# Altium project smart generator controller.PrjPcb
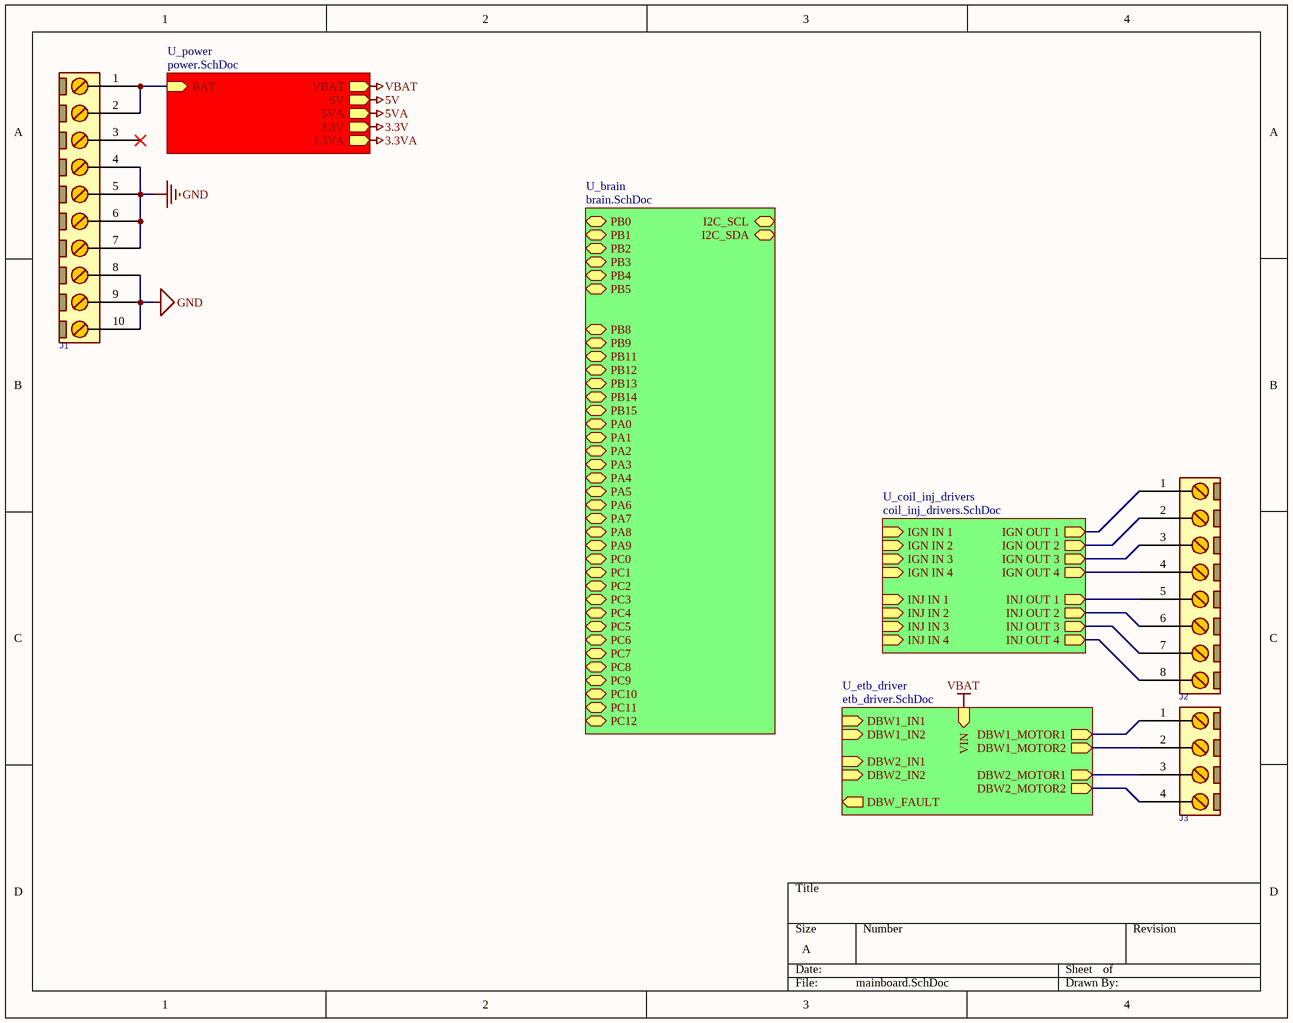
[diagram p0: mainboard.SchDoc]
8 sheets, 276 parts. Net scope: hierarchical (ports join the sheet entries above them; power ports are global).
Board file: PCB1.PcbDoc
Sheets:
  mainboard.SchDoc
    U_etb_driver = etb_driver.SchDoc
    U_brain = brain.SchDoc
    U_power = power.SchDoc
    U_coil_inj_drivers = coil_inj_drivers.SchDoc
  trigger_interface.SchDoc
  output_drivers.SchDoc
  exhaust_gas_temp_oxy.SchDoc

## Sheet mainboard.SchDoc
size A; SheetNumber: 1; SheetTotal: 5

### Parts
J1  CONN_TB10  [MSTB_10]  (value not drawn)
J2  CONN_TB8  [MSTB_8]  (value not drawn)
J3  CONN_TB4  [MSTB_4]  (value not drawn)

### Sub-sheets
U_brain = brain.SchDoc: PB0 (bidir), PB1 (bidir), PB2 (bidir), PB3 (bidir), PB4 (bidir), PB5 (bidir), I2C_SCL (bidir), I2C_SDA (bidir), PB8 (bidir), PB9 (bidir), PB11 (bidir), PB12 (bidir), PB13 (bidir), PB14 (bidir), PB15 (bidir), PA0 (bidir), PA1 (bidir), PA2 (bidir), PA3 (bidir), PA4 (bidir), PA5 (bidir), PA6 (bidir), PA7 (bidir), PA8 (bidir), PA9 (bidir), PC0 (bidir), PC1 (bidir), PC2 (bidir), PC3 (bidir), PC4 (bidir), PC5 (bidir), PC6 (bidir), PC7 (bidir), PC8 (bidir), PC9 (bidir), PC10 (bidir), PC11 (bidir), PC12 (bidir)
U_coil_inj_drivers = coil_inj_drivers.SchDoc: IGN IN 1 (in), IGN IN 2 (in), IGN IN 3 (in), IGN IN 4 (in), IGN OUT 1 (out), IGN OUT 2 (out), IGN OUT 3 (out), IGN OUT 4 (out), INJ OUT 4 (out), INJ OUT 3 (out), INJ OUT 2 (out), INJ OUT 1 (out), INJ IN 1 (in), INJ IN 2 (in), INJ IN 3 (in), INJ IN 4 (in)
U_etb_driver = etb_driver.SchDoc: VIN (in), DBW1_IN1 (in), DBW1_IN2 (in), DBW2_IN1 (in), DBW2_IN2 (in), DBW1_MOTOR1 (out), DBW1_MOTOR2 (out), DBW2_MOTOR1 (out), DBW2_MOTOR2 (out), DBW_FAULT (out)
U_power = power.SchDoc: BAT (in), VBAT (out), 5V (out), 5VA (out), 3.3V (out), 3.3VA (out)

### Nets
GND: J1.4 J1.5 J1.6 J1.7 J1.8 J1.9 J1.10
VBAT: sheet U_etb_driver/VIN, sheet U_power/VBAT
NetD1_1: J2.5 ; sheet U_coil_inj_drivers/INJ OUT 1
NetD1_2: J2.6 J2.7 J2.8 ; sheet U_coil_inj_drivers/INJ OUT 4, sheet U_coil_inj_drivers/INJ OUT 3, sheet U_coil_inj_drivers/INJ OUT 2
NetF2_1: J1.1 J1.2 ; sheet U_power/BAT
NetJ2_1: J2.1 ; sheet U_coil_inj_drivers/IGN OUT 1
NetJ2_2: J2.2 ; sheet U_coil_inj_drivers/IGN OUT 2
NetJ2_3: J2.3 ; sheet U_coil_inj_drivers/IGN OUT 3
NetJ2_4: J2.4 ; sheet U_coil_inj_drivers/IGN OUT 4
NetJ3_1: J3.1 ; sheet U_etb_driver/DBW1_MOTOR1
NetJ3_2: J3.2 ; sheet U_etb_driver/DBW1_MOTOR2
NetJ3_3: J3.3 ; sheet U_etb_driver/DBW2_MOTOR1
NetJ3_4: J3.4 ; sheet U_etb_driver/DBW2_MOTOR2

Not connected (* = marked no-connect by the designer): J1 3*

### Library data of the parts
J1 = CONN_MSTB_10: CONN, PHOENIX MSTB, 5-G, 5.08mm pitch; PARAM2: 320V; PARAM: 12A; VALUE: CONN_TB10
J2 = CONN_MSTB_8: CONN, PHOENIX MSTB, 5-G, 5.08mm pitch; PARAM2: 320V; PARAM: 12A; VALUE: CONN_TB8
J3 = CONN_MSTB_4: CONN, PHOENIX MSTB, 5-G, 5.08mm pitch; PARAM2: 320V; PARAM: 12A; VALUE: CONN_TB4

## Sheet etb_driver.SchDoc
size A4; SheetNumber: 4; SheetTotal: 8
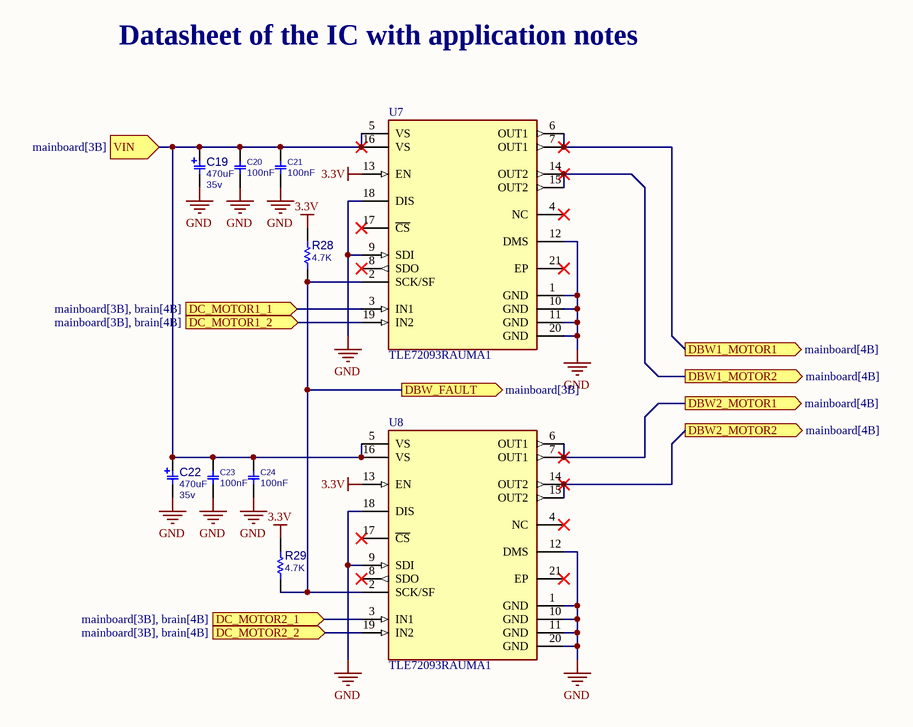
[diagram p1: etb_driver.SchDoc]

### Parts
C19  PARAM2: 35v  [C_EL_D10L10]  (hidden comment: 470uF)
C20  100nF  [C1206]
C21  100nF  [C1206]
C22  PARAM2: 35v  [C_EL_D10L10]  (hidden comment: 470uF)
C23  100nF  [C1206]
C24  100nF  [C1206]
R28  4.7K  [R0805]
R29  4.7K  [R0805]  (no BOM)
U7  TLE72093RAUMA1  [FP-PG-DSO-20-MFG]
U8  TLE72093RAUMA1  [FP-PG-DSO-20-MFG]

### Ports
DBW1_MOTOR1 (out, see mainboard[4B]), DBW1_MOTOR2 (out, see mainboard[4B]), DBW2_MOTOR1 (out, see mainboard[4B]), DBW2_MOTOR2 (out, see mainboard[4B]), DBW_FAULT (out, see mainboard[3B]), DC_MOTOR1_1 (in, see mainboard[3B], brain[4B]), DC_MOTOR1_2 (in, see mainboard[3B], brain[4B]), DC_MOTOR2_1 (in, see mainboard[3B], brain[4B]), DC_MOTOR2_2 (in, see mainboard[3B], brain[4B]), VIN (in, see mainboard[3B])

### Nets
3.3V: R28.2 R29.2 U7.13(EN) U8.13(EN)
GND: C19.2 C20.1 C21.1 C22.2 C23.1 C24.1 U7.1(GND) U7.9(SDI) U7.10(GND) U7.11(GND) U7.12(DMS) U7.18(DIS) U7.20(GND) U8.1(GND) U8.9(SDI) U8.10(GND) U8.11(GND) U8.12(DMS) U8.18(DIS) U8.20(GND)
VBAT: C19.1 C20.2 C21.2 C22.1 C23.2 C24.2 U7.5(VS) U7.16(VS) U8.5(VS) U8.16(VS) ; port VIN
NetJ3_1: U7.6(OUT1) U7.7(OUT1) ; port DBW1_MOTOR1
NetJ3_2: U7.14(OUT2) U7.15(OUT2) ; port DBW1_MOTOR2
NetJ3_3: U8.6(OUT1) U8.7(OUT1) ; port DBW2_MOTOR1
NetJ3_4: U8.14(OUT2) U8.15(OUT2) ; port DBW2_MOTOR2
NetR28_1: R28.1 R29.1 U7.2(SCK/SF) U8.2(SCK/SF) ; port DBW_FAULT
NetU7_3: U7.3(IN1) ; port DC_MOTOR1_1
NetU7_19: U7.19(IN2) ; port DC_MOTOR1_2
NetU8_3: U8.3(IN1) ; port DC_MOTOR2_1
NetU8_19: U8.19(IN2) ; port DC_MOTOR2_2

Not connected (* = marked no-connect by the designer): U7 4(NC)* 8(SDO)* 17(~{CS})* 21(EP)*; U8 4(NC)* 8(SDO)* 17(~{CS})* 21(EP)*

### Notes on the sheet
- Datasheet of the IC with application notes <https://www.infineon.com/dgdl/Infineon-TLE7209_2R-DS-v01_05-en.pdf?fileId=db3a30431f848401011fc76ca8e77a06>

### Library data of the parts
C19 C22 = CAP_SMD_EL_470uF_35v: CAP, SMD, ELEC,; MANF_P#: MANF_PART#; DESC: DESCRIPTION; DIST#: MOUSER; PARAM: 20%; PRICE: 10= -$; MANF: MANF; ASSEMBLY: ASSEMBLY; VALUE: 470uF
C20 C21 C23 C24 = CAP_SMD_MLCC_1206: CAP, MLCC; PARAM: -, -%; MANF_P#: MANF_PART#; PARAM2: -V; PRICE: 100= 1$; MANF: -; ASSEMBLY: ASSEMBLY; VALUE: 100nF
R28 R29 = RES_SMD_0805: RESISTOR, SMD; PARAM: -W; DESC: DESCRIPTION; DIST#: MOUSER; PARAM2: 1%; MANF_P#: -; MANF: -; ASSEMBLY: ASSEMBLY; PRICE: 100= 0.5$; VALUE: 4.7K
U7 U8 = TLE7209: IC MOTOR DRIVER 3.5V-5.5V 20DSO; Logic Function: AND GATE; Max Supply Voltage: 28V; Output Current: 5A; Interface: SPI; RoHS Compliant: Yes; Lead Free: Contains Lead; Series: -; Max Operating Temperature: 150°C; Packaging: Tape and Reel; Mount: Surface Mount; Halogen Free: Halogen Free; Min Operating Temperature: -40°C

## Sheet brain.SchDoc
size A3; SheetNumber: 5; SheetTotal: 8
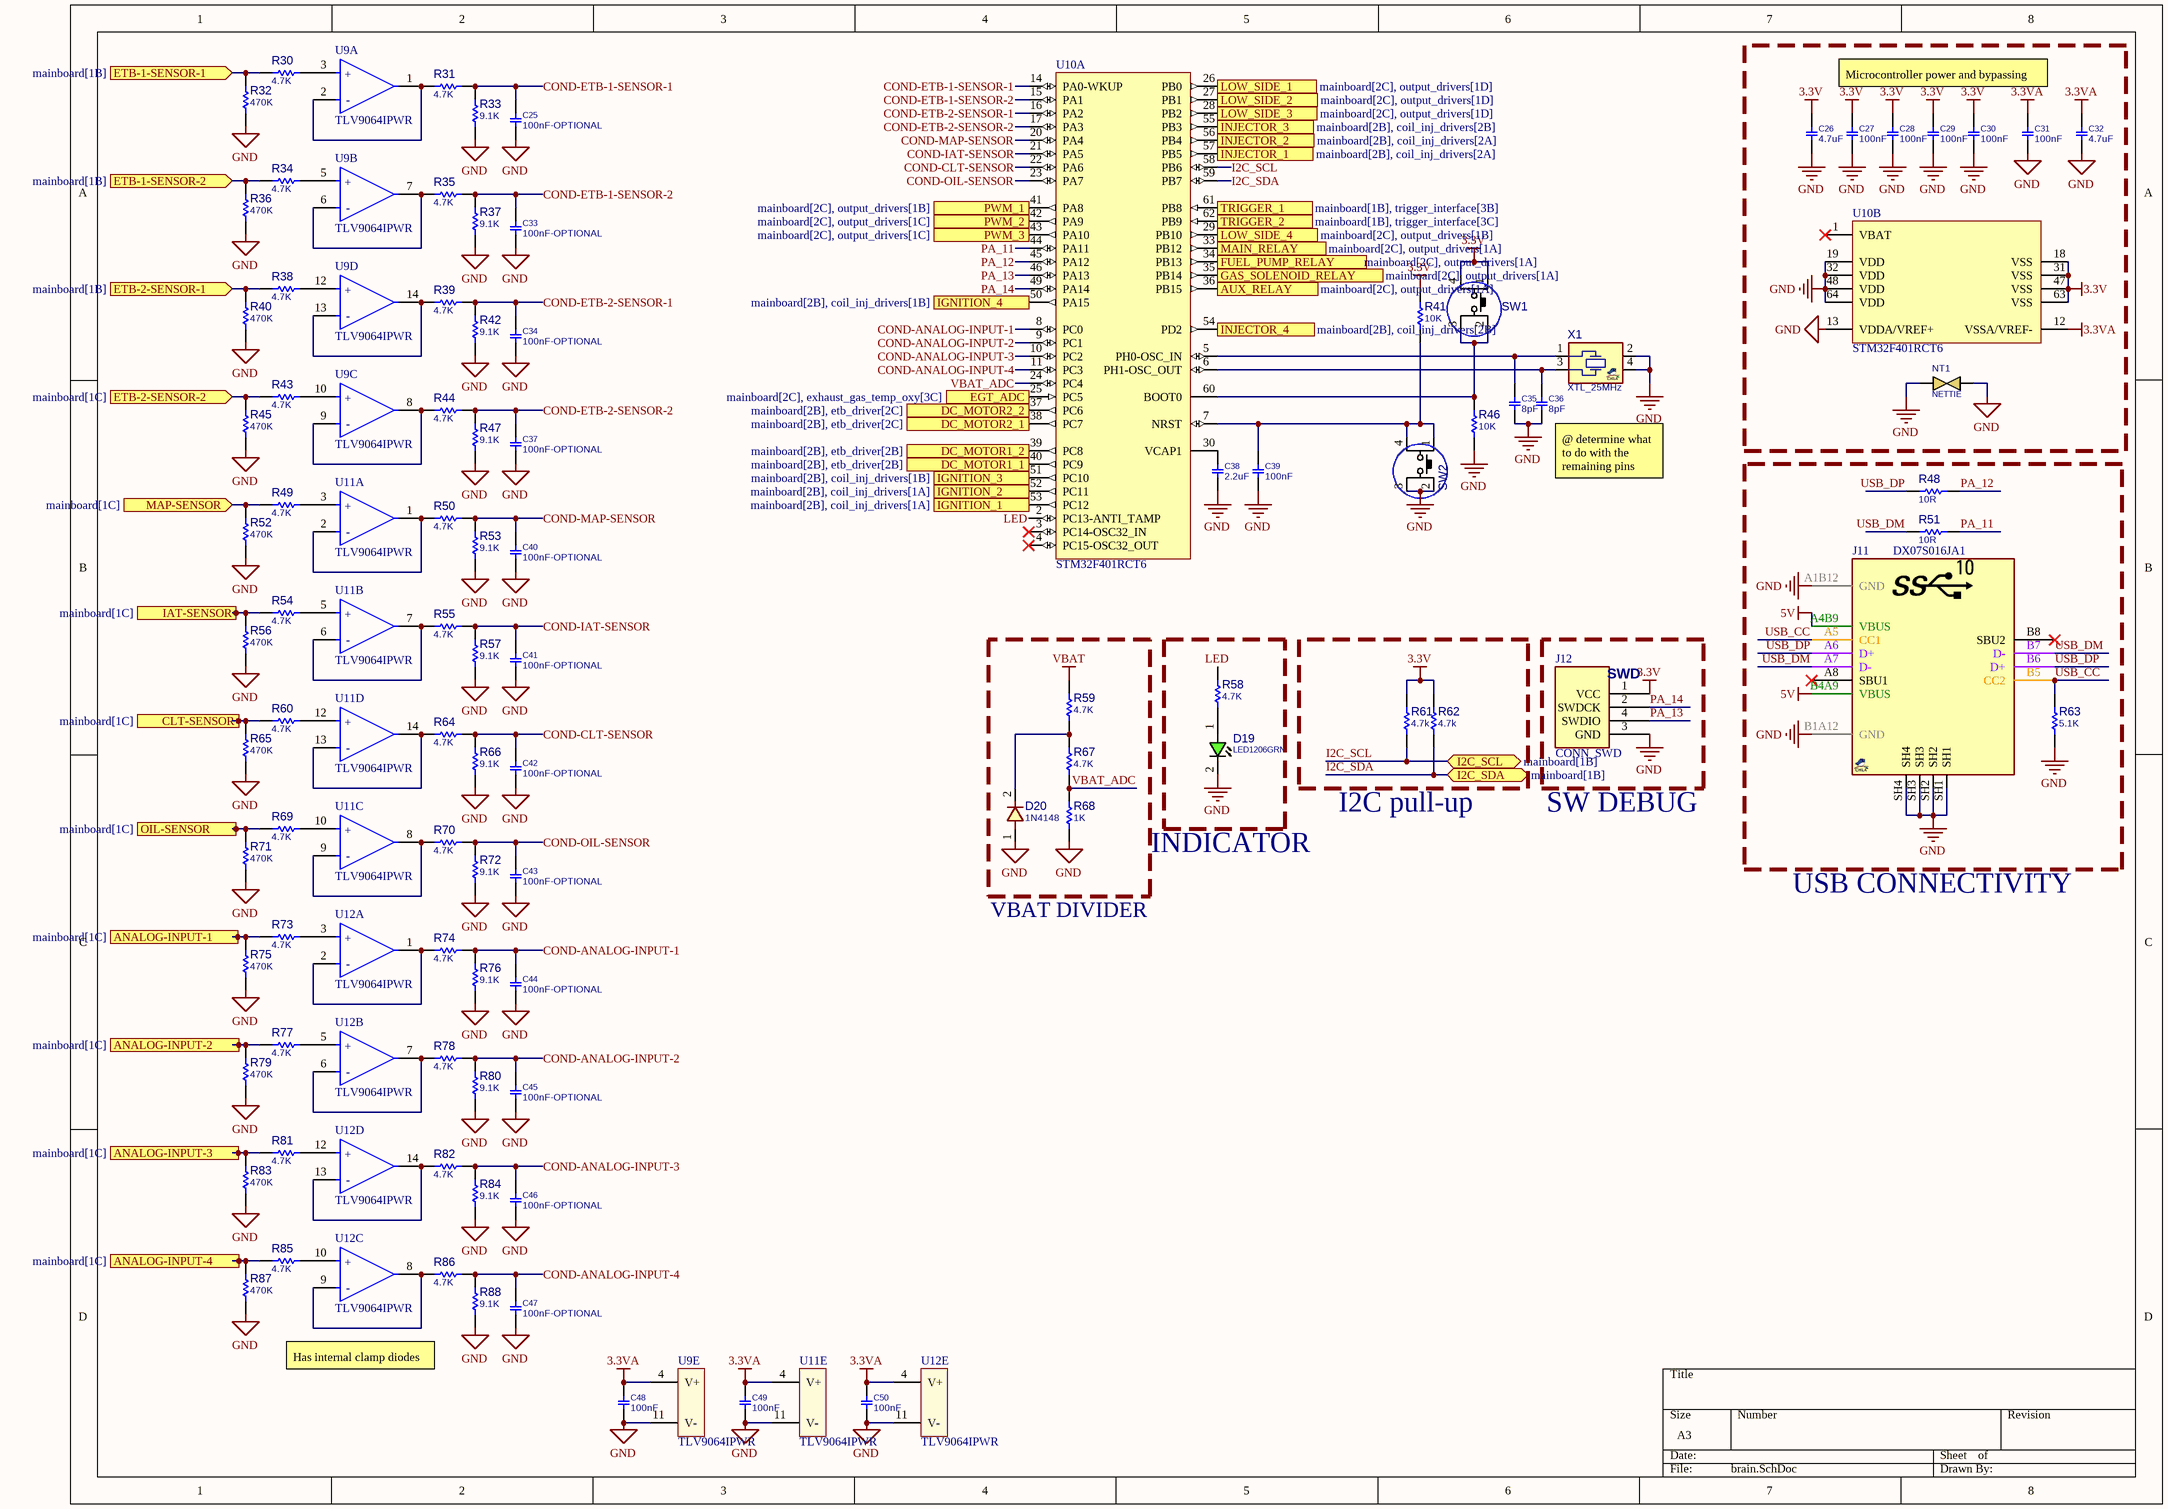
[diagram p2: brain.SchDoc]

### Parts
C25  100nF-OPTIONAL  [C0805]
C26  4.7uF  [C0805]
C27  100nF  [C0805]
C28  100nF  [C0805]
C29  100nF  [C0805]
C30  100nF  [C0805]
C31  100nF  [C0805]
C32  4.7uF  [C0805]
C33  100nF-OPTIONAL  [C0805]
C34  100nF-OPTIONAL  [C0805]
C35  8pF  [C0805]
C36  8pF  [C0805]
C37  100nF-OPTIONAL  [C0805]
C38  2.2uF  [C0805]
C39  100nF  [C0805]
C40  100nF-OPTIONAL  [C0805]
C41  100nF-OPTIONAL  [C0805]
C42  100nF-OPTIONAL  [C0805]
C43  100nF-OPTIONAL  [C0805]
C44  100nF-OPTIONAL  [C0805]
C45  100nF-OPTIONAL  [C0805]
C46  100nF-OPTIONAL  [C0805]
C47  100nF-OPTIONAL  [C0805]
C48  100nF  [C0805]
C49  100nF  [C0805]
C50  100nF  [C0805]
D19  LED1206GRN  [LED1206GRN]
D20  1N4148  [D_SOD80]
J11  DX07S016JA1  [USBC_SMD_16_DX07S016JA1]
J12  CONN_SWD  [WF_4]
NT1  NETTIE  [NETTIE_40X50]  (net tie, no BOM)
R30  4.7K  [R0805]
R31  4.7K  [R0805]
R32  470K  [R0805]
R33  9.1K  [R0805]
R34  4.7K  [R0805]
R35  4.7K  [R0805]
R36  470K  [R0805]
R37  9.1K  [R0805]
R38  4.7K  [R0805]
R39  4.7K  [R0805]
R40  470K  [R0805]
R41  10K  [R0805]
R42  9.1K  [R0805]
R43  4.7K  [R0805]
R44  4.7K  [R0805]
R45  470K  [R0805]
R46  10K  [R0805]
R47  9.1K  [R0805]
R48  10R  [R0805]
R49  4.7K  [R0805]
R50  4.7K  [R0805]
R51  10R  [R0805]
R52  470K  [R0805]
R53  9.1K  [R0805]
R54  4.7K  [R0805]
R55  4.7K  [R0805]
R56  470K  [R0805]
R57  9.1K  [R0805]
R58  4.7K  [R0805]
R59  4.7K  [R0805]
R60  4.7K  [R0805]
R61  4.7k  [R0805]
R62  4.7k  [R0805]
R63  5.1K  [R1206]
R64  4.7K  [R0805]
R65  470K  [R0805]
R66  9.1K  [R0805]
R67  4.7K  [R0805]
R68  1K  [R0805]
R69  4.7K  [R0805]
R70  4.7K  [R0805]
R71  470K  [R0805]
R72  9.1K  [R0805]
R73  4.7K  [R0805]
R74  4.7K  [R0805]
R75  470K  [R0805]
R76  9.1K  [R0805]
R77  4.7K  [R0805]
R78  4.7K  [R0805]
R79  470K  [R0805]
R80  9.1K  [R0805]
R81  4.7K  [R0805]
R82  4.7K  [R0805]
R83  470K  [R0805]
R84  9.1K  [R0805]
R85  4.7K  [R0805]
R86  4.7K  [R0805]
R87  470K  [R0805]
R88  9.1K  [R0805]
SW1  PUSHBUTTON  [SWPBS_SPDT_5X5X1]  (value not drawn)
SW2  PUSHBUTTON  [SWPBS_SPDT_5X5X1]  (value not drawn)
U9  TLV9064IPWR  [TTSOP-14]  (parts A,B,C,D,E of 5)
U10  STM32F401RCT6  [STM-LQFP64_L]  (parts A,B of 2)
U11  TLV9064IPWR  [TTSOP-14]  (parts A,B,C,D,E of 5)
U12  TLV9064IPWR  [TTSOP-14]  (parts A,B,C,D,E of 5)
X1  XTL_25MHz  [XTL_4_3225]

### Blocks framed on the sheet
VBAT DIVIDER: D20 R59 R67 R68

### Ports
ANALOG-INPUT-1 (in, see mainboard[1C]), ANALOG-INPUT-2 (in, see mainboard[1C]), ANALOG-INPUT-3 (in, see mainboard[1C]), ANALOG-INPUT-4 (in, see mainboard[1C]), AUX_RELAY (out, see mainboard[2C], output_drivers[1A]), CLT-SENSOR (in, see mainboard[1C]), DC_MOTOR1_1 (out, see mainboard[2B], etb_driver[2B]), DC_MOTOR1_2 (out, see mainboard[2B], etb_driver[2B]), DC_MOTOR2_1 (out, see mainboard[2B], etb_driver[2C]), DC_MOTOR2_2 (out, see mainboard[2B], etb_driver[2C]), EGT_ADC (in, see mainboard[2C], exhaust_gas_temp_oxy[3C]), ETB-1-SENSOR-1 (in, see mainboard[1B]), ETB-1-SENSOR-2 (in, see mainboard[1B]), ETB-2-SENSOR-1 (in, see mainboard[1B]), ETB-2-SENSOR-2 (in, see mainboard[1C]), FUEL_PUMP_RELAY (out, see mainboard[2C], output_drivers[1A]), GAS_SOLENOID_RELAY (out, see mainboard[2C], output_drivers[1A]), I2C_SCL (bidir, see mainboard[1B]), I2C_SDA (bidir, see mainboard[1B]), IAT-SENSOR (in, see mainboard[1C]), IGNITION_1 (out, see mainboard[2B], coil_inj_drivers[1A]), IGNITION_2 (out, see mainboard[2B], coil_inj_drivers[1A]), IGNITION_3 (out, see mainboard[2B], coil_inj_drivers[1B]), IGNITION_4 (out, see mainboard[2B], coil_inj_drivers[1B]), INJECTOR_1 (out, see mainboard[2B], coil_inj_drivers[2A]), INJECTOR_2 (out, see mainboard[2B], coil_inj_drivers[2A]), INJECTOR_3 (out, see mainboard[2B], coil_inj_drivers[2B]), INJECTOR_4 (out, see mainboard[2B], coil_inj_drivers[2B]), LOW_SIDE_1 (out, see mainboard[2C], output_drivers[1D]), LOW_SIDE_2 (out, see mainboard[2C], output_drivers[1D]), LOW_SIDE_3 (out, see mainboard[2C], output_drivers[1D]), LOW_SIDE_4 (out, see mainboard[2C], output_drivers[1B]), MAIN_RELAY (out, see mainboard[2C], output_drivers[1A]), MAP-SENSOR (in, see mainboard[1C]), OIL-SENSOR (in, see mainboard[1C]), PWM_1 (out, see mainboard[2C], output_drivers[1B]), PWM_2 (out, see mainboard[2C], output_drivers[1C]), PWM_3 (out, see mainboard[2C], output_drivers[1C]), TRIGGER_1 (in, see mainboard[1B], trigger_interface[3B]), TRIGGER_2 (in, see mainboard[1B], trigger_interface[3C])

### Nets
3.3V: C26.2 C27.2 C28.2 C29.2 C30.2 J12.1(VCC) R41.2 R61.2 R62.2 SW1.1(P1) SW1.4(P2) U10.18(VSS) U10.31(VSS) U10.47(VSS) U10.63(VSS)
3.3VA: C31.2 C32.2 C48.2 C49.2 C50.2 U9.4(V+) U10.12(VSSA/VREF-) U11.4(V+) U12.4(V+)
5V: J11.A4B9(VBUS) J11.B4A9(VBUS)
GND: C25.1 C26.1 C27.1 C28.1 C29.1 C30.1 C31.1 C32.1 C33.1 C34.1 C35.1 C36.1 C37.1 C38.1 C39.1 C40.1 C41.1 C42.1 C43.1 C44.1 C45.1 C46.1 C47.1 C48.1 C49.1 C50.1 D19.2(CATHODE) D20.1 J11.A1B12(GND) J11.B1A12(GND) J11.SH1 J11.SH2 J11.SH3 J11.SH4 J12.3(GND) NT1.1 NT1.2 R32.2 R33.2 R36.2 R37.2 R40.2 R42.2 R45.2 R46.1 R47.2 R52.2 R53.2 R56.2 R57.2 R63.1 R65.2 R66.2 R68.1 R71.2 R72.2 R75.2 R76.2 R79.2 R80.2 R83.2 R84.2 R87.2 R88.2 SW2.2(P3) SW2.3(P4) U9.11(V-) U10.13(VDDA/VREF+) U10.19(VDD) U10.32(VDD) U10.48(VDD) U10.64(VDD) U11.11(V-) U12.11(V-) X1.2 X1.4
VBAT: R59.2
COND-ANALOG-INPUT-1: C44.2 R74.1 R76.1 U10.8(PC0)
COND-ANALOG-INPUT-2: C45.2 R78.1 R80.1 U10.9(PC1)
COND-ANALOG-INPUT-3: C46.2 R82.1 R84.1 U10.10(PC2)
COND-ANALOG-INPUT-4: C47.2 R86.1 R88.1 U10.11(PC3)
COND-CLT-SENSOR: C42.2 R64.1 R66.1 U10.22(PA6)
COND-ETB-1-SENSOR-1: C25.2 R31.1 R33.1 U10.14(PA0-WKUP)
COND-ETB-1-SENSOR-2: C33.2 R35.1 R37.1 U10.15(PA1)
COND-ETB-2-SENSOR-1: C34.2 R39.1 R42.1 U10.16(PA2)
COND-ETB-2-SENSOR-2: C37.2 R44.1 R47.1 U10.17(PA3)
COND-IAT-SENSOR: C41.2 R55.1 R57.1 U10.21(PA5)
COND-MAP-SENSOR: C40.2 R50.1 R53.1 U10.20(PA4)
COND-OIL-SENSOR: C43.2 R70.1 R72.1 U10.23(PA7)
I2C_SCL: R61.1 U10.58(PB6) ; port I2C_SCL
I2C_SDA: R62.1 U10.59(PB7) ; port I2C_SDA
LED: R58.2 U10.2(PC13-ANTI_TAMP)
PA_11: R51.1 U10.44(PA11)
PA_12: R48.1 U10.45(PA12)
PA_13: J12.4(SWDIO) U10.46(PA13)
PA_14: J12.2(SWDCK) U10.49(PA14)
USB_CC: J11.A5(CC1) J11.B5(CC2) R63.2
USB_DM: J11.A7(D-) J11.B7(D-) R51.2
USB_DP: J11.A6(D+) J11.B6(D+) R48.2
VBAT_ADC: R67.1 R68.2 U10.24(PC4)
NetC35_2: C35.2 U10.5(PH0-OSC_IN) X1.1
NetC36_2: C36.2 U10.6(PH1-OSC_OUT) X1.3
NetC38_2: C38.2 U10.30(VCAP1)
NetC39_2: C39.2 R41.1 SW2.1(P1) SW2.4(P2) U10.7(NRST)
NetD19_1: D19.1(ANODE) R58.1
NetD20_2: D20.2 R59.1 R67.2
NetR30_1: R30.1 U9.3(IN1+)
NetR30_2: R30.2 R32.1 ; port ETB-1-SENSOR-1
NetR31_2: R31.2 U9.1(OUT1) U9.2(IN1-)
NetR34_1: R34.1 U9.5(IN2+)
NetR34_2: R34.2 R36.1 ; port ETB-1-SENSOR-2
NetR35_2: R35.2 U9.6(IN2-) U9.7(OUT2)
NetR38_1: R38.1 U9.12(IN4+)
NetR38_2: R38.2 R40.1 ; port ETB-2-SENSOR-1
NetR39_2: R39.2 U9.13(IN4-) U9.14(OUT4)
NetR43_1: R43.1 U9.10(IN3+)
NetR43_2: R43.2 R45.1 ; port ETB-2-SENSOR-2
NetR44_2: R44.2 U9.8(OUT3) U9.9(IN3-)
NetR46_2: R46.2 SW1.2(P3) SW1.3(P4) U10.60(BOOT0)
NetR49_1: R49.1 U11.3(IN1+)
NetR49_2: R49.2 R52.1 ; port MAP-SENSOR
NetR50_2: R50.2 U11.1(OUT1) U11.2(IN1-)
NetR54_1: R54.1 U11.5(IN2+)
NetR54_2: R54.2 R56.1 ; port IAT-SENSOR
NetR55_2: R55.2 U11.6(IN2-) U11.7(OUT2)
NetR60_1: R60.1 U11.12(IN4+)
NetR60_2: R60.2 R65.1 ; port CLT-SENSOR
NetR64_2: R64.2 U11.13(IN4-) U11.14(OUT4)
NetR69_1: R69.1 U11.10(IN3+)
NetR69_2: R69.2 R71.1 ; port OIL-SENSOR
NetR70_2: R70.2 U11.8(OUT3) U11.9(IN3-)
NetR73_1: R73.1 U12.3(IN1+)
NetR73_2: R73.2 R75.1 ; port ANALOG-INPUT-1
NetR74_2: R74.2 U12.1(OUT1) U12.2(IN1-)
NetR77_1: R77.1 U12.5(IN2+)
NetR77_2: R77.2 R79.1 ; port ANALOG-INPUT-2
NetR78_2: R78.2 U12.6(IN2-) U12.7(OUT2)
NetR81_1: R81.1 U12.12(IN4+)
NetR81_2: R81.2 R83.1 ; port ANALOG-INPUT-3
NetR82_2: R82.2 U12.13(IN4-) U12.14(OUT4)
NetR85_1: R85.1 U12.10(IN3+)
NetR85_2: R85.2 R87.1 ; port ANALOG-INPUT-4
NetR86_2: R86.2 U12.8(OUT3) U12.9(IN3-)
NetU10_25: U10.25(PC5) ; port EGT_ADC
NetU10_26: U10.26(PB0) ; port LOW_SIDE_1
NetU10_27: U10.27(PB1) ; port LOW_SIDE_2
NetU10_28: U10.28(PB2) ; port LOW_SIDE_3
NetU10_29: U10.29(PB10) ; port LOW_SIDE_4
NetU10_33: U10.33(PB12) ; port MAIN_RELAY
NetU10_34: U10.34(PB13) ; port FUEL_PUMP_RELAY
NetU10_35: U10.35(PB14) ; port GAS_SOLENOID_RELAY
NetU10_36: U10.36(PB15) ; port AUX_RELAY
NetU10_37: U10.37(PC6) ; port DC_MOTOR2_2
NetU10_38: U10.38(PC7) ; port DC_MOTOR2_1
NetU10_39: U10.39(PC8) ; port DC_MOTOR1_2
NetU10_40: U10.40(PC9) ; port DC_MOTOR1_1
NetU10_41: U10.41(PA8) ; port PWM_1
NetU10_42: U10.42(PA9) ; port PWM_2
NetU10_43: U10.43(PA10) ; port PWM_3
NetU10_50: U10.50(PA15) ; port IGNITION_4
NetU10_51: U10.51(PC10) ; port IGNITION_3
NetU10_52: U10.52(PC11) ; port IGNITION_2
NetU10_53: U10.53(PC12) ; port IGNITION_1
NetU10_54: U10.54(PD2) ; port INJECTOR_4
NetU10_55: U10.55(PB3) ; port INJECTOR_3
NetU10_56: U10.56(PB4) ; port INJECTOR_2
NetU10_57: U10.57(PB5) ; port INJECTOR_1
NetU10_61: U10.61(PB8) ; port TRIGGER_1
NetU10_62: U10.62(PB9) ; port TRIGGER_2

Not connected (* = marked no-connect by the designer): J11 A8(SBU1)* B8(SBU2)*; U10 1(VBAT)* 3(PC14-OSC32_IN)* 4(PC15-OSC32_OUT)*

### Notes on the sheet
- Microcontroller power and bypassing
- (near C36) @ determine what to do with the remaining pins
- INDICATOR
- I2C pull-up
- (near J12) SW DEBUG
- USB CONNECTIVITY
- Has internal clamp diodes
- (in symbol CONN_SWD) SWD
- (in symbol TLV9064, part A) +; -
- (in symbol TLV9064, part B) +; -
- (in symbol TLV9064, part C) +; -
- (in symbol TLV9064, part D) +; -

### Library data of the parts
C25-C50 = CAP_SMD_MLCC: CAP, MLCC; PARAM: C0G, 10%; DESC: CAP, MLCC, 1nF, 50V, C0G, 10%, 0402; MANF_P#: MANF_PART#; MANF: Murata; PARAM2: 50V; PRICE: 100= 1$; ASSEMBLY: ASSEMBLY
  C25 C33 C34 C37 C40-C47: VALUE: 100nF-OPTIONAL
  C26 C32: VALUE: 4.7uF
  C27-C31 C39 C48-C50: VALUE: 100nF
  C35 C36: VALUE: 8pF
  C38: VALUE: 2.2uF
D19 = LED_SMD_1206_GRN: LED, SMD, 1206, GREEN; PARAM: 20mA; DESC: DESCRIPTION; PARAM2: 2.2V; MANF: -; ASSEMBLY: ASSEMBLY; PRICE: 36t@Javan; MANF_P#: -; VALUE: LED1206GRN
D20 = DIODE_SMD_1N4148_SOD80: DIODE, FAST SWTICHING, 0.3A, 0.5W; DESC: DESCRIPTION; PARAM: 75V; PARAM2: 300mA, 0.5W; MANF: MANF; ASSEMBLY: ASSEMBLY; PRICE: PRICE; MANF_P#: 1N4148; VALUE: 1N4148
J11 = CONN_USBC_SMD_16_DX07S016JA1: CONN, USB, Type C, USB 2.0, Right-Angle, SMD; MANF: JAE; MANF_P#: DX07S016JA1R1500; PARAM: 5A; Price: 1.5$; Value: DX07S016JA1
J12 = CONN_SWD: CONN, SWD, ST; VALUE: CONN_SWD
NT1 = NETTIE_40X50: NET TIE; MANF: -; MANF_P#: -; VALUE: NETTIE
R30-R47 R49 R50 R52-R62 R64-R88 = RES_SMD: RESISTOR, SMD; PARAM: -W; DESC: DESCRIPTION; DIST#: MOUSER; PARAM2: 1%; MANF_P#: -; MANF: -; ASSEMBLY: ASSEMBLY; PRICE: 100= 0.5$
  R30 R31 R34 R35 R38 R39 R43 R44 R49 R50 R54 R55 R58-R60 R64 R67 R69 R70 R73 R74 R77 R78 R81 R82 R85 R86: VALUE: 4.7K
  R32 R36 R40 R45 R52 R56 R65 R71 R75 R79 R83 R87: VALUE: 470K
  R33 R37 R42 R47 R53 R57 R66 R72 R76 R80 R84 R88: VALUE: 9.1K
  R41 R46: VALUE: 10K
  R61 R62: VALUE: 4.7k
  R68: VALUE: 1K
R48 R51 = RES_SMD_0805: as R28 on sheet etb_driver; MANF_P#: -; MANF: -; ASSEMBLY: ASSEMBLY; PRICE: 100= 0.5$; VALUE: 10R
R63 = RES_SMD_1206: RESISTOR, SMD; PARAM: 1%, 0.25W; DESC: DESCRIPTION; DIST#: MOUSER; MANF_P#: -; MANF: -; ASSEMBLY: ASSEMBLY; PRICE: -; PARAM2: -; VALUE: 5.1K
SW1 SW2 = SWPBS_SPDT_5X5PTS: SWITCH, PUSH BUTTON, TACTILE, SMD, SPDT, 5X5MM; MANF: CHINA; PARAM: 50mA; DESC: DESCRIPTION; MANF_P#: PTS526SM15SMTR2LFS; PARAM2: 500kCycle; VALUE: PUSHBUTTON; ASSEMBLY: ASSEMBLY; PRICE: -
U9 U11 U12 = TLV9064: IC CMOS 4 CIRCUIT 14TSSOP; Output Current per Channel: 50mA; Gain Bandwidth Product: 10MHz; Operating Supply Current: 538uA; Input Bias Current: 0.5pA; Input Offset Voltage (Vos): 300uV; Number of Channels: 4; Slew Rate: 6.5V/µs; Mount: Surface Mount; Min Operating Temperature: -40°C; Case/Package: TSSOP; RoHS Compliant: Yes; Packaging: Tape and Reel; Number of Pins: 14; Number of Circuits: 4; Max Operating Temperature: 125°C
U10 = STM32F401RCT6: ARM Cortex-M4 32-bit MCU+FPU, 105 DMIPS, 256 kB Flash, 64 kB Internal RAM, 48 I/Os, 64-pin LQFP, -40 to 85 degC, Tray; Manufacturer: STMicroelectronics; Internal RAM Size (kB): 64; Supply Voltage(Vcc) max (V): 3.6; FLASH Size (Prog) (kB): 256; I/Os (High Current): 48; Operating Frequency(F) (Processor speed) (MHz): 84; Supply Voltage(Vcc) min (V): 1.8; DatasheetVersion: Rev. 1; ComponentLink1URL: http://www.st.com/web/en/home.html; ComponentLink1Description: Manufacturer URL; PackageDescription: 64-Pin Low Profile Quad Flat Package, 10 x 10 mm Body, 0.5 mm Pitch; Packing: Tray; ComponentLink3URL: http://www.st.com/st-web-ui/static/active/en/resource/technical/document/datasheet/DM00037051.pdf; PackageVersion: Rev. 4, 06/2013; ComponentLink2URL: http://www.st.com/st-web-ui/static/active/en/resource/technical/document/data_brief/DM00071938.pdf; PartNumber: STM32F401RCT6; PackageReference: LQFP64; Mounting Technology: Surface Mount; ComponentLink2Description: Datasheet; ComponentLink3Description: Package Specification; Core: ARM Cortex-M4
X1 = XTL_4_25MHZ_3225A_2: CRYSTAL 25.00 MHZ 4pF, 10PPM; MANF: ABRACON; PARAM: 10PPM, 4pF, -40~85oC; DESC: DESCRIPTION; DIST#: MOUSER; MANF_P#: ABM8W-25.0000MHZ-4-D1X-T3; PARAM2: 0.6$; ASSEMBLY: ASSEMBLY; PRICE: PRICE; VALUE: XTL_25MHz

## Sheet power.SchDoc
size A; SheetNumber: 3; SheetTotal: 8
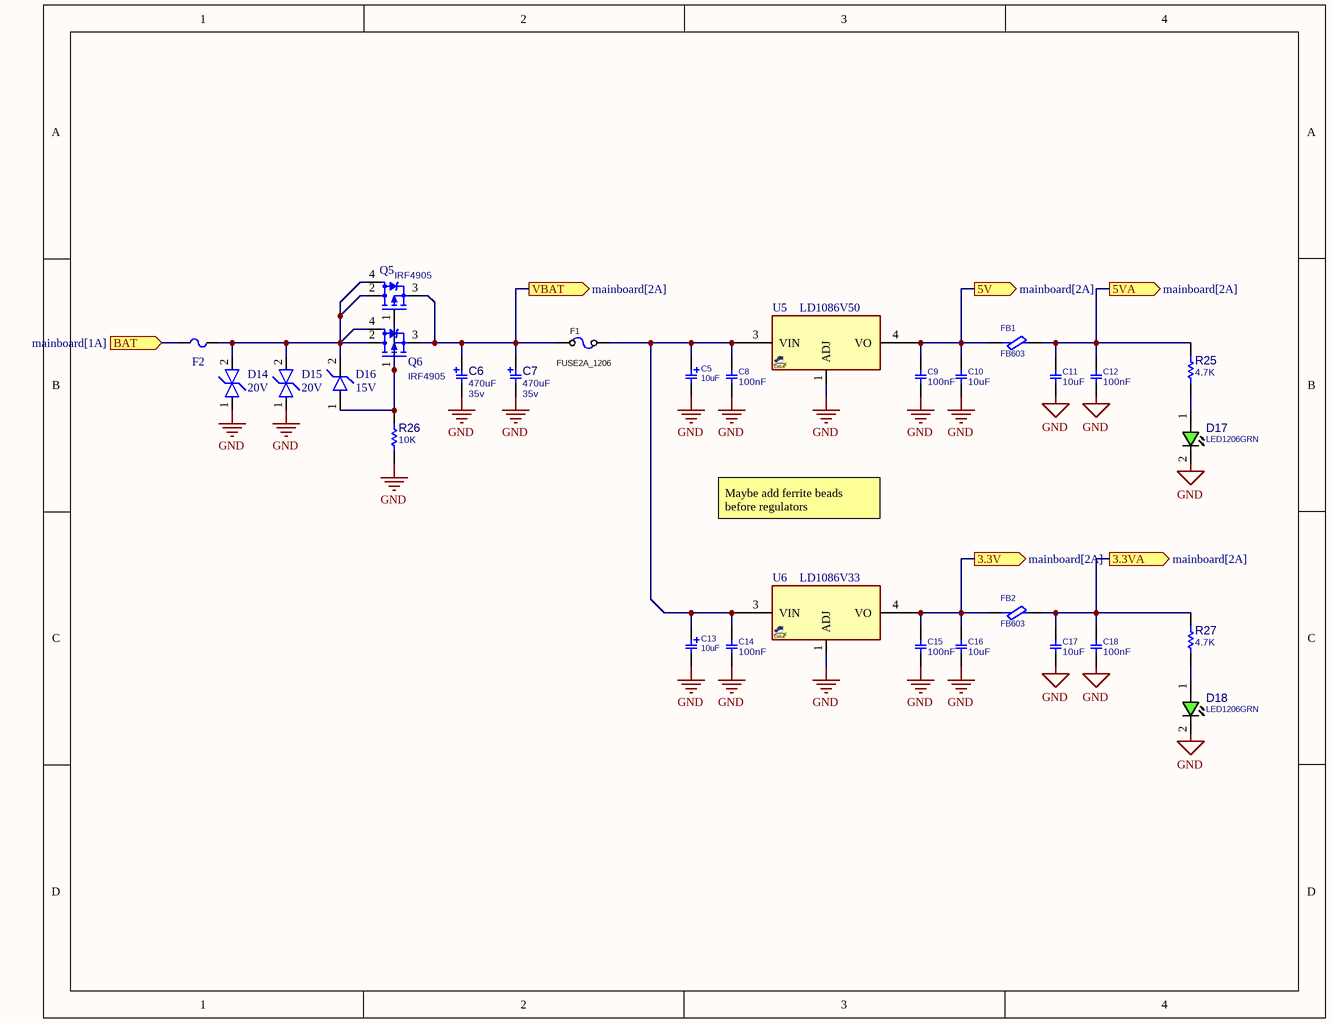
[diagram p3: power.SchDoc]

### Parts
C5  10uF  [C_TN_7343]
C6  PARAM2: 35v  [C_EL_D10L10]  (hidden comment: 470uF)
C7  PARAM2: 35v  [C_EL_D10L10]  (hidden comment: 470uF)
C8  100nF  [C1206]
C9  100nF  [C1206]
C10  10uF  [C1206]
C11  10uF  [C1206]
C12  100nF  [C1206]
C13  10uF  [C_TN_7343]
C14  100nF  [C1206]
C15  100nF  [C1206]
C16  10uF  [C1206]
C17  10uF  [C1206]
C18  100nF  [C1206]
D14  20V  [FP-SMBJ-CA-MFG]
D15  20V  [FP-SMBJ-CA-MFG]
D16  15V  [D_SOD80]
D17  LED1206GRN  [LED1206GRN]
D18  LED1206GRN  [LED1206GRN]
F1  FUSE2A_1206  [F1206]
F2  F=1.0 A  [FUSE - Double PAD]  (value not drawn)
FB1  FB603  [L1206]
FB2  FB603  [L1206]
Q5  IRF4905  [D2PAK_3]
Q6  IRF4905  [D2PAK_3]
R25  4.7K  [R1206]
R26  10K  [R1206]
R27  4.7K  [R1206]
U5  LD1086V50  [DPAK_3]
U6  LD1086V33  [DPAK_3]

### Ports
3.3V (out, see mainboard[2A]), 3.3VA (out, see mainboard[2A]), 5V (out, see mainboard[2A]), 5VA (out, see mainboard[2A]), BAT (in, see mainboard[1A]), VBAT (out, see mainboard[2A])

### Nets
3.3V: C15.2 C16.2 FB2.2 U6.4(VO) ; port 3.3V
3.3VA: C17.2 C18.2 FB2.1 R27.2 ; port 3.3VA
5V: C9.2 C10.2 FB1.2 U5.4(VO) ; port 5V
5VA: C11.2 C12.2 FB1.1 R25.2 ; port 5VA
GND: C5.2 C6.2 C7.2 C8.1 C9.1 C10.1 C11.1 C12.1 C13.2 C14.1 C15.1 C16.1 C17.1 C18.1 D14.1 D15.1 D17.2(CATHODE) D18.2(CATHODE) R26.1 U5.1(ADJ) U6.1(ADJ)
VBAT: C6.1 C7.1 F1.1 Q5.3(S) Q6.3(S) ; port VBAT
NetC5_1: C5.1 C8.2 C13.1 C14.2 F1.2 U5.3(VIN) U6.3(VIN)
NetD14_2: D14.2 D15.2 D16.2 F2.2 Q5.2(D) Q5.4(D) Q6.2(D) Q6.4(D)
NetD16_1: D16.1 Q5.1(G) Q6.1(G) R26.2
NetD17_1: D17.1(ANODE) R25.1
NetD18_1: D18.1(ANODE) R27.1
NetF2_1: F2.1 ; port BAT

### Notes on the sheet
- Maybe add ferrite beads before regulators

### Library data of the parts
C5 C13 = CAP_SMD_TAN_10uF_35V: CAP, SMD, TAN; PARAM: 20%, 300mOhm, -55~125oC; MANF: VISHAY; MANF_P#: 593D106X9035D2TE3; PARAM2: 35V; PRICE: 0.8$; VALUE: 10uF
C6 C7 = CAP_SMD_EL_470uF_35v: as C19 on sheet etb_driver; PRICE: 10= -$; MANF: MANF; ASSEMBLY: ASSEMBLY; VALUE: 470uF
C8 C9 C12 C14 C15 C18 = CAP_SMD_MLCC_1206: as C20 on sheet etb_driver; PRICE: 100= 1$; MANF: -; ASSEMBLY: ASSEMBLY; VALUE: 100nF
C10 C11 C16 C17 = CAP_SMD_MLCC: as C25 on sheet brain; PRICE: 100= 1$; ASSEMBLY: ASSEMBLY; VALUE: 10uF
D14 D15 = TVS: TVS DIODE; Direction: Bidirectional; Reverse Standoff Voltage: 20V; ComponentLink2Description: Datasheet; ComponentLink2URL: https://www.bourns.com/docs/Product-Datasheets/SMBJ.pdf
D16 = Zener-SOD-80
D17 D18 = LED_SMD_1206_GRN: as D19 on sheet brain; MANF: -; ASSEMBLY: ASSEMBLY; PRICE: 36t@Javan; MANF_P#: -; VALUE: LED1206GRN
F1 = FUSE_3A_1206_SLOW: Fuse, 3A, 32VDC, 1206, SMD, Slow Blow; PARAM: 3A; 32VDC; Slow Blow; MANF: Bourns; MANF_P#: SF-1206SP300-2; PARAM2: 0.027Ohm; PRICE: 0.9$; VALUE: FUSE2A_1206
F2 = Fuse 5x20 with holdeer pins: Fuses 5x20; Designer: Abbas Basereh; Desc.: fuse with holder pins 5x20; Data: 28-12-2016
FB1 FB2 = FBEAD_SMD: FERRITE_Bead, SMD; MANF: MURATA; PARAM: 120@100MHz; PARAM2: 1A; MANF_P#: BLM15AG121SN1D; VALUE: FB603
Q5 Q6 = MOSP_IRF4905_D2PAK: HEXFET Power MOSFET; ASSEMBLY: ASSEMBLY; MANF_P#: IRF4905; VALUE: IRF4905
R25-R27 = RES_SMD_1206: as R63 on sheet brain; MANF_P#: -; MANF: -; ASSEMBLY: ASSEMBLY; PRICE: -; PARAM2: -
  R25 R27: VALUE: 4.7K
  R26: VALUE: 10K
U5 U6 = VREG_1086_TO252: REG, Linear, LDO1.3, Adj, 1A, TO-252; MANF_P#: LD1086DTTR, LD1086D2MTR; MANF: ST; PARAM2: 2.8~30VIN, 1.3VDROP, 1.25VREF; PARAM: 1A
  U5: VALUE: LD1086V50
  U6: VALUE: LD1086V33

## Sheet coil_inj_drivers.SchDoc
size A; SheetNumber: 2; SheetTotal: 5
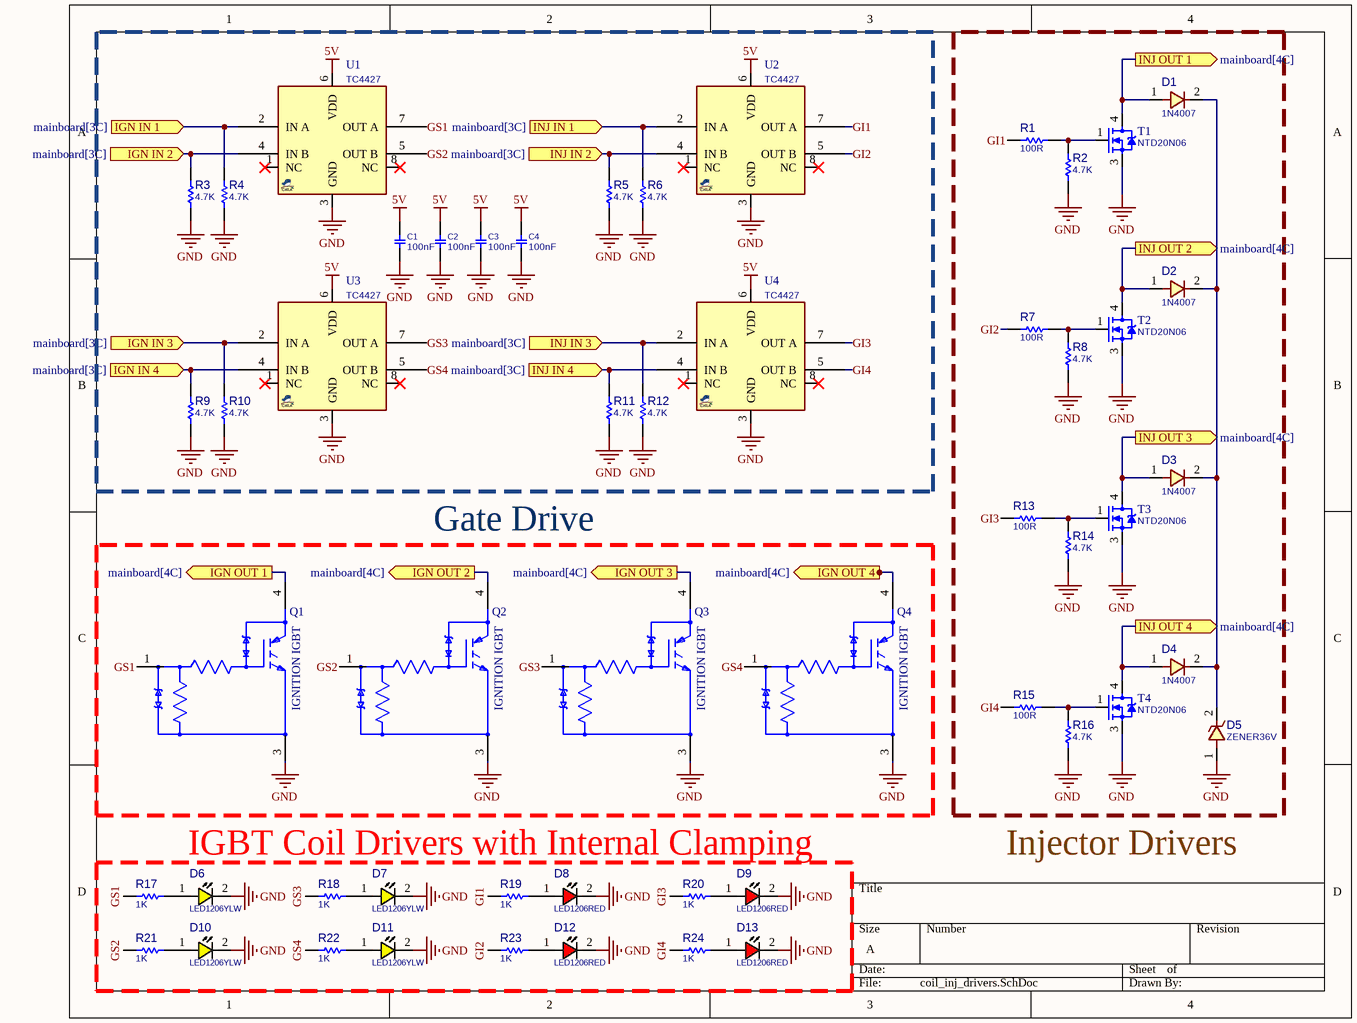
[diagram p4: coil_inj_drivers.SchDoc]

### Parts
C1  100nF  [C1206]
C2  100nF  [C1206]
C3  100nF  [C1206]
C4  100nF  [C1206]
D1  1N4007  [D_SMA]
D2  1N4007  [D_SMA]
D3  1N4007  [D_SMA]
D4  1N4007  [D_SMA]
D5  ZENER36V  [D_SMB]
D6  LED1206YLW  [LED1206YLW]
D7  LED1206YLW  [LED1206YLW]
D8  LED1206RED  [LED1206RED]
D9  LED1206RED  [LED1206RED]
D10  LED1206YLW  [LED1206YLW]
D11  LED1206YLW  [LED1206YLW]
D12  LED1206RED  [LED1206RED]
D13  LED1206RED  [LED1206RED]
Q1  IGNITION IGBT  [FP-369AS-MFG]
Q2  IGNITION IGBT  [FP-369AS-MFG]
Q3  IGNITION IGBT  [FP-369AS-MFG]
Q4  IGNITION IGBT  [FP-369AS-MFG]
R1  100R  [R1206]
R2  4.7K  [R1206]
R3  4.7K  [R1206]
R4  4.7K  [R1206]
R5  4.7K  [R1206]
R6  4.7K  [R1206]
R7  100R  [R1206]
R8  4.7K  [R1206]
R9  4.7K  [R1206]
R10  4.7K  [R1206]
R11  4.7K  [R1206]
R12  4.7K  [R1206]
R13  100R  [R1206]
R14  4.7K  [R1206]
R15  100R  [R1206]
R16  4.7K  [R1206]
R17  1K  [R1206]
R18  1K  [R1206]
R19  1K  [R1206]
R20  1K  [R1206]
R21  1K  [R1206]
R22  1K  [R1206]
R23  1K  [R1206]
R24  1K  [R1206]
T1  NTD20N06  [DPAK_3]
T2  NTD20N06  [DPAK_3]
T3  NTD20N06  [DPAK_3]
T4  NTD20N06  [DPAK_3]
U1  TC4427  [SO_8]
U2  TC4427  [SO_8]
U3  TC4427  [SO_8]
U4  TC4427  [SO_8]

### Ports
IGN IN 1 (in, see mainboard[3C]), IGN IN 2 (in, see mainboard[3C]), IGN IN 3 (in, see mainboard[3C]), IGN IN 4 (in, see mainboard[3C]), IGN OUT 1 (out, see mainboard[4C]), IGN OUT 2 (out, see mainboard[4C]), IGN OUT 3 (out, see mainboard[4C]), IGN OUT 4 (out, see mainboard[4C]), INJ IN 1 (in, see mainboard[3C]), INJ IN 2 (in, see mainboard[3C]), INJ IN 3 (in, see mainboard[3C]), INJ IN 4 (in, see mainboard[3C]), INJ OUT 1 (out, see mainboard[4C]), INJ OUT 2 (out, see mainboard[4C]), INJ OUT 3 (out, see mainboard[4C]), INJ OUT 4 (out, see mainboard[4C])

### Nets
5V: C1.2 C2.2 C3.2 C4.2 U1.6(VDD) U2.6(VDD) U3.6(VDD) U4.6(VDD)
GND: C1.1 C2.1 C3.1 C4.1 D5.1 D6.2(CATHODE) D7.2(CATHODE) D8.2(CATHODE) D9.2(CATHODE) D10.2(CATHODE) D11.2(CATHODE) D12.2(CATHODE) D13.2(CATHODE) Q1.3(E) Q2.3(E) Q3.3(E) Q4.3(E) R2.1 R3.1 R4.1 R5.1 R6.1 R8.1 R9.1 R10.1 R11.1 R12.1 R14.1 R16.1 T1.3(S) T2.3(S) T3.3(S) T4.3(S) U1.3(GND) U2.3(GND) U3.3(GND) U4.3(GND)
GI1: R1.2 R19.2 U2.7(OUT_A)
GI2: R7.2 R23.2 U2.5(OUT_B)
GI3: R13.2 R20.2 U4.7(OUT_A)
GI4: R15.2 R24.2 U4.5(OUT_B)
GS1: Q1.1(G) R17.2 U1.7(OUT_A)
GS2: Q2.1(G) R21.2 U1.5(OUT_B)
GS3: Q3.1(G) R18.2 U3.7(OUT_A)
GS4: Q4.1(G) R22.2 U3.5(OUT_B)
NetD1_1: D1.1 T1.4(D) ; port INJ OUT 1
NetD1_2: D1.2 D2.1 D2.2 D3.1 D3.2 D4.1 D4.2 D5.2 T2.4(D) T3.4(D) T4.4(D) ; port INJ OUT 4, port INJ OUT 3, port INJ OUT 2
NetD6_1: D6.1(ANODE) R17.1
NetD7_1: D7.1(ANODE) R18.1
NetD8_1: D8.1(ANODE) R19.1
NetD9_1: D9.1(ANODE) R20.1
NetD10_1: D10.1(ANODE) R21.1
NetD11_1: D11.1(ANODE) R22.1
NetD12_1: D12.1(ANODE) R23.1
NetD13_1: D13.1(ANODE) R24.1
NetJ2_1: Q1.4(C) ; port IGN OUT 1
NetJ2_2: Q2.4(C) ; port IGN OUT 2
NetJ2_3: Q3.4(C) ; port IGN OUT 3
NetJ2_4: Q4.4(C) ; port IGN OUT 4
NetR1_1: R1.1 R2.2 T1.1(G)
NetR3_2: R3.2 U1.4(IN_B) ; port IGN IN 2
NetR4_2: R4.2 U1.2(IN_A) ; port IGN IN 1
NetR5_2: R5.2 U2.4(IN_B) ; port INJ IN 2
NetR6_2: R6.2 U2.2(IN_A) ; port INJ IN 1
NetR7_1: R7.1 R8.2 T2.1(G)
NetR9_2: R9.2 U3.4(IN_B) ; port IGN IN 4
NetR10_2: R10.2 U3.2(IN_A) ; port IGN IN 3
NetR11_2: R11.2 U4.4(IN_B) ; port INJ IN 4
NetR12_2: R12.2 U4.2(IN_A) ; port INJ IN 3
NetR13_1: R13.1 R14.2 T3.1(G)
NetR15_1: R15.1 R16.2 T4.1(G)

Not connected (* = marked no-connect by the designer): U1 1(NC)* 8(NC)*; U2 1(NC)* 8(NC)*; U3 1(NC)* 8(NC)*; U4 1(NC)* 8(NC)*

### Notes on the sheet
- Gate Drive
- IGBT Coil Drivers with Internal Clamping
- Injector Drivers

### Library data of the parts
C1-C4 = CAP_SMD_MLCC: as C25 on sheet brain; PRICE: 100= 1$; ASSEMBLY: ASSEMBLY; VALUE: 100nF
D1-D4 = DIODE_SMD_1N4007: DIODE, GENERAL PURPOSE, 1000V/1A; MANF: Kingtronics; DESC: DESCRIPTION; PARAM: 1000V VRRM; PARAM2: 1A; MANF_P#: M7; ASSEMBLY: ASSEMBLY; PRICE: PRICE; VALUE: 1N4007
D5 = DIODE_SMD_ZENER_Z2SMB36: DIODE, ZENER, 2W, 36V; MANF: Diotec; DESC: DESCRIPTION; PARAM: 2W, 16Ohm, -50~150°C; ASSEMBLY: ASSEMBLY; PRICE: -; PARAM2: 36V; MANF_P#: Z2SMB36; VALUE: ZENER36V
D6 D7 D10 D11 = LED_SMD_1206_YLW: LED, SMD, 1206, YELLOW; DESC: DESCRIPTION; MANF_P#: MANF_PART#; PARAM2: 2.2V; MANF: MANF; ASSEMBLY: ASSEMBLY; PRICE: 36t@Javan; VALUE: LED1206YLW
D8 D9 D12 D13 = LED_SMD_1206_RED: LED, SMD, 1206, RED; DESC: DESCRIPTION; MANF_P#: MANF_PART#; PARAM2: 2.2V; MANF: MANF; ASSEMBLY: ASSEMBLY; PRICE: 36t@Javan; VALUE: LED1206RED
Q1-Q4 = IGNITION IGBT: NexarPartId: 87655026; Collector Emitter Saturation Voltage: 1.15V; Collector Emitter Voltage (VCEO): 1.5V; Max Collector Current: 41A; Element Configuration: Single; Max Breakdown Voltage: 400V; Max Power Dissipation: 150W; Radiation Hardening: No; RoHS: Compliant; Schedule B: 8541290080, 8541290080|8541290080, 8541290080|8541290080|8541290080, 8541290080|8541290080|8541290080|8541290080; Number of Pins: 3; Max Operating Temperature: 175°C; Mount: Surface Mount; Case/Package: DPAK; Min Operating Temperature: -55°C; Clamping Voltage: 400V; Weight: 260.37mg; Collector Emitter Breakdown Voltage: 400V
R1-R24 = RES_SMD_1206: as R63 on sheet brain; MANF_P#: -; MANF: -; ASSEMBLY: ASSEMBLY; PRICE: -; PARAM2: -
  R1 R7 R13 R15: VALUE: 100R
  R2-R6 R8-R12 R14 R16: VALUE: 4.7K
  R17-R24: VALUE: 1K
T1-T4 = MOSN_NTD20N06_DPAK: MOSFET, N-CH, 60V, 20A, 39mRDS, 1~2VGSth; MANF_P#: NTD20N06L; PARAM2: 60VDS, 1~2VGSth; PARAM: 20A, 39mRDS, Cin700pF, -55~150oC; MANF: ON; ASSEMBLY: ASSEMBLY; PRICE: 0.9$; VALUE: NTD20N06
U1-U4 = MOS_DUAL_TC4427: power Mosfet Driver, Dual, High-Speed, 1.5A; ASSEMBLY: ASSEMBLY; MANF_P#: TC4427; VALUE: TC4427

## Sheet trigger_interface.SchDoc
size A4; SheetNumber: 6; SheetTotal: 8
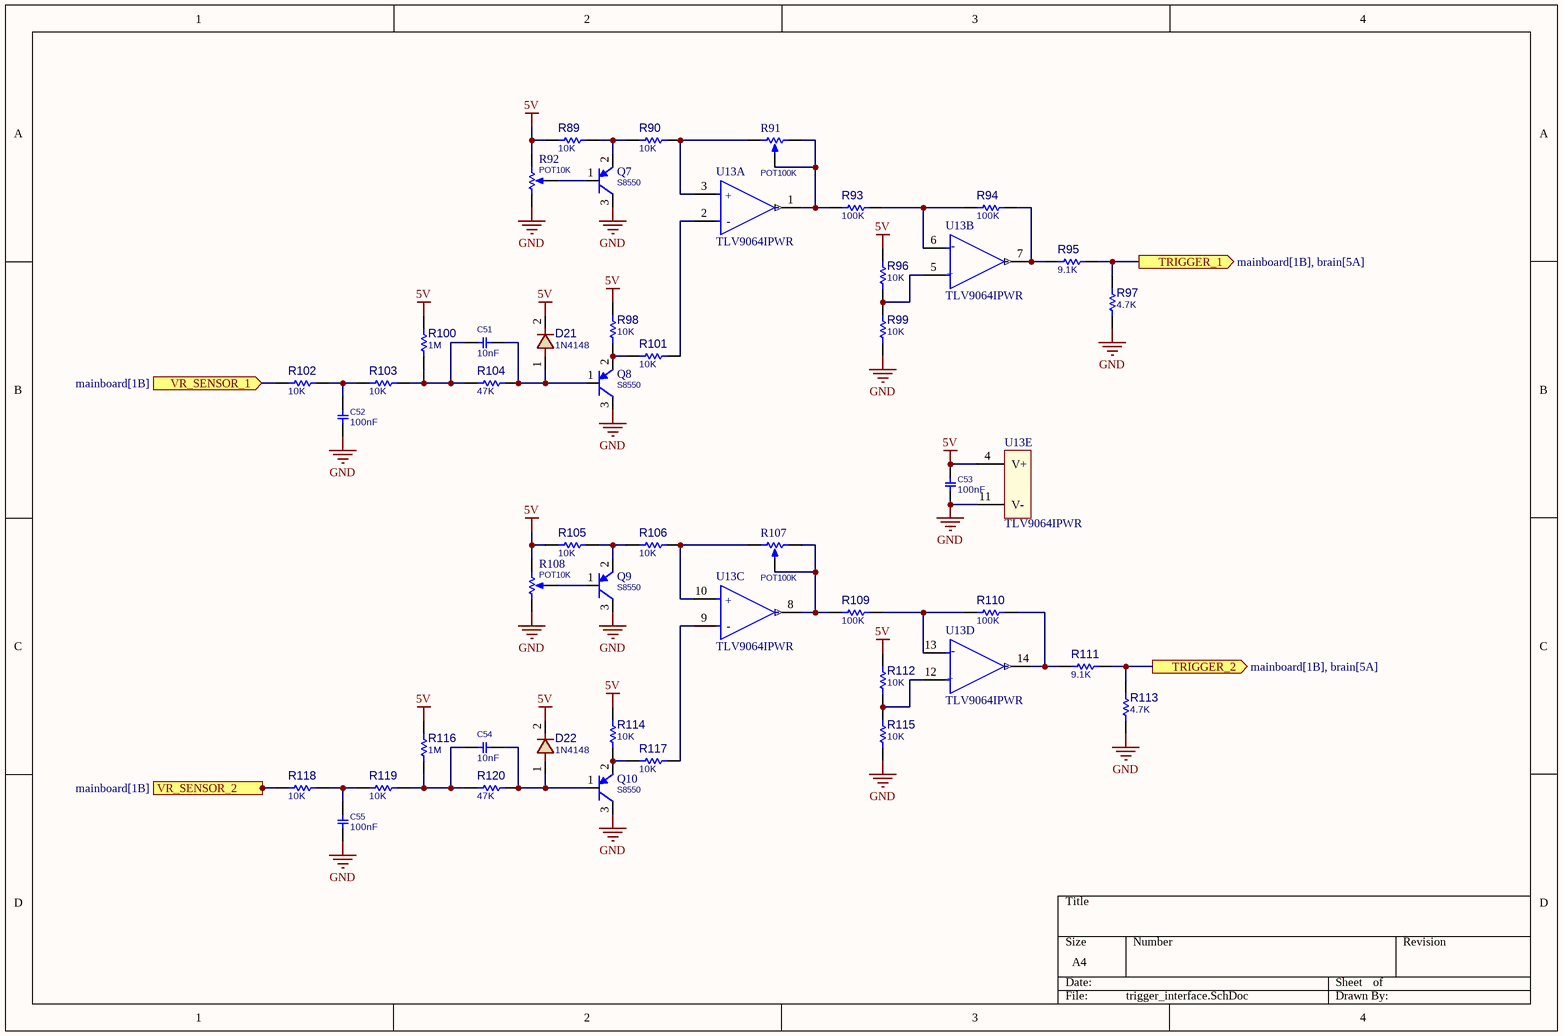
[diagram p5: trigger_interface.SchDoc]

### Parts
C51  10nF  [C0805]
C52  100nF  [C0805]
C53  100nF  [C0805]
C54  10nF  [C0805]
C55  100nF  [C0805]
D21  1N4148  [D_SOD80]
D22  1N4148  [D_SOD80]
Q7  S8550  [SOT23_3]
Q8  S8550  [SOT23_3]
Q9  S8550  [SOT23_3]
Q10  S8550  [SOT23_3]
R89  10K  [R0805]
R90  10K  [R0805]
R91  POT100K  [POT_7X5]
R92  POT10K  [POT_7X5]
R93  100K  [R0805]
R94  100K  [R0805]
R95  9.1K  [R0805]
R96  10K  [R0805]
R97  4.7K  [R0805]
R98  10K  [R0805]
R99  10K  [R0805]
R100  1M  [R0805]
R101  10K  [R0805]
R102  10K  [R0805]
R103  10K  [R0805]
R104  47K  [R0805]
R105  10K  [R0805]
R106  10K  [R0805]
R107  POT100K  [POT_7X5]
R108  POT10K  [POT_7X5]
R109  100K  [R0805]
R110  100K  [R0805]
R111  9.1K  [R0805]
R112  10K  [R0805]
R113  4.7K  [R0805]
R114  10K  [R0805]
R115  10K  [R0805]
R116  1M  [R0805]
R117  10K  [R0805]
R118  10K  [R0805]
R119  10K  [R0805]
R120  47K  [R0805]
U13  TLV9064IPWR  [TTSOP-14]  (parts A,B,C,D,E of 5)

### Ports
TRIGGER_1 (out, see mainboard[1B], brain[5A]), TRIGGER_2 (out, see mainboard[1B], brain[5A]), VR_SENSOR_1 (in, see mainboard[1B]), VR_SENSOR_2 (in, see mainboard[1B])

### Nets
5V: C53.2 D21.2 D22.2 R89.1 R92.3(BOT) R96.2 R98.1 R100.1 R105.1 R108.3(BOT) R112.2 R114.1 R116.1 U13.4(V+)
GND: C52.1 C53.1 C55.1 Q7.3(C) Q8.3(C) Q9.3(C) Q10.3(C) R92.1(TOP) R97.1 R99.2 R108.1(TOP) R113.1 R115.2 U13.11(V-)
NetC51_1: C51.1 D21.1 Q8.1(B) R104.1
NetC51_2: C51.2 R100.2 R103.1 R104.2
NetC52_2: C52.2 R102.1 R103.2
NetC54_1: C54.1 D22.1 Q10.1(B) R120.1
NetC54_2: C54.2 R116.2 R119.1 R120.2
NetC55_2: C55.2 R118.1 R119.2
NetQ7_1: Q7.1(B) R92.2(TAP)
NetQ7_2: Q7.2(E) R89.2 R90.1
NetQ8_2: Q8.2(E) R98.2 R101.1
NetQ9_1: Q9.1(B) R108.2(TAP)
NetQ9_2: Q9.2(E) R105.2 R106.1
NetQ10_2: Q10.2(E) R114.2 R117.1
NetR90_2: R90.2 R91.1(TOP) U13.3(IN1+)
NetR91_2: R91.2(TAP) R91.3(BOT) R93.1 U13.1(OUT1)
NetR93_2: R93.2 R94.1 U13.6(IN2-)
NetR94_2: R94.2 R95.1 U13.7(OUT2)
NetR95_2: R95.2 R97.2 ; port TRIGGER_1
NetR96_1: R96.1 R99.1 U13.5(IN2+)
NetR101_2: R101.2 U13.2(IN1-)
NetR102_2: R102.2 ; port VR_SENSOR_1
NetR106_2: R106.2 R107.1(TOP) U13.10(IN3+)
NetR107_2: R107.2(TAP) R107.3(BOT) R109.1 U13.8(OUT3)
NetR109_2: R109.2 R110.1 U13.13(IN4-)
NetR110_2: R110.2 R111.1 U13.14(OUT4)
NetR111_2: R111.2 R113.2 ; port TRIGGER_2
NetR112_1: R112.1 R115.1 U13.12(IN4+)
NetR117_2: R117.2 U13.9(IN3-)
NetR118_2: R118.2 ; port VR_SENSOR_2

### Notes on the sheet
- (in symbol TLV9064, part A) +; -
- (in symbol TLV9064, part B) -; +
- (in symbol TLV9064, part C) +; -
- (in symbol TLV9064, part D) -; +

### Library data of the parts
C51-C55 = CAP_SMD_MLCC: as C25 on sheet brain; PRICE: 100= 1$; ASSEMBLY: ASSEMBLY
  C51 C54: VALUE: 10nF
  C52 C53 C55: VALUE: 100nF
D21 D22 = DIODE_SMD_1N4148_SOD80: as D20 on sheet brain; MANF: MANF; ASSEMBLY: ASSEMBLY; PRICE: PRICE; MANF_P#: 1N4148; VALUE: 1N4148
Q7-Q10 = PNP_S8550_SOT23: BJT, PNP, 25v, 0.5A, SMD, SOT23; PARAM2: 300mW; PARAM: 25v, 0.5A; MANF_P#: S8550; MANF: -; VALUE: S8550
R89 R90 R93-R106 R109-R120 = RES_SMD: as R30 on sheet brain; MANF_P#: -; MANF: -; ASSEMBLY: ASSEMBLY; PRICE: 100= 0.5$
  R89 R90 R96 R98 R99 R101-R103 R105 R106 R112 R114 R115 R117-R119: VALUE: 10K
  R93 R94 R109 R110: VALUE: 100K
  R95 R111: VALUE: 9.1K
  R97 R113: VALUE: 4.7K
  R100 R116: VALUE: 1M
  R104 R120: VALUE: 47K
R91 R92 R107 R108 = RES_THD_POT_7X5: RESISTOR, THD, Potentiometer
  R91 R107: VALUE: POT100K
  R92 R108: VALUE: POT10K
U13 = TLV9064: as U9 on sheet brain; Mount: Surface Mount; Min Operating Temperature: -40°C; Case/Package: TSSOP; RoHS Compliant: Yes; Packaging: Tape and Reel; Number of Pins: 14; Number of Circuits: 4; Max Operating Temperature: 125°C

## Sheet output_drivers.SchDoc
size A4; SheetNumber: 7; SheetTotal: 8
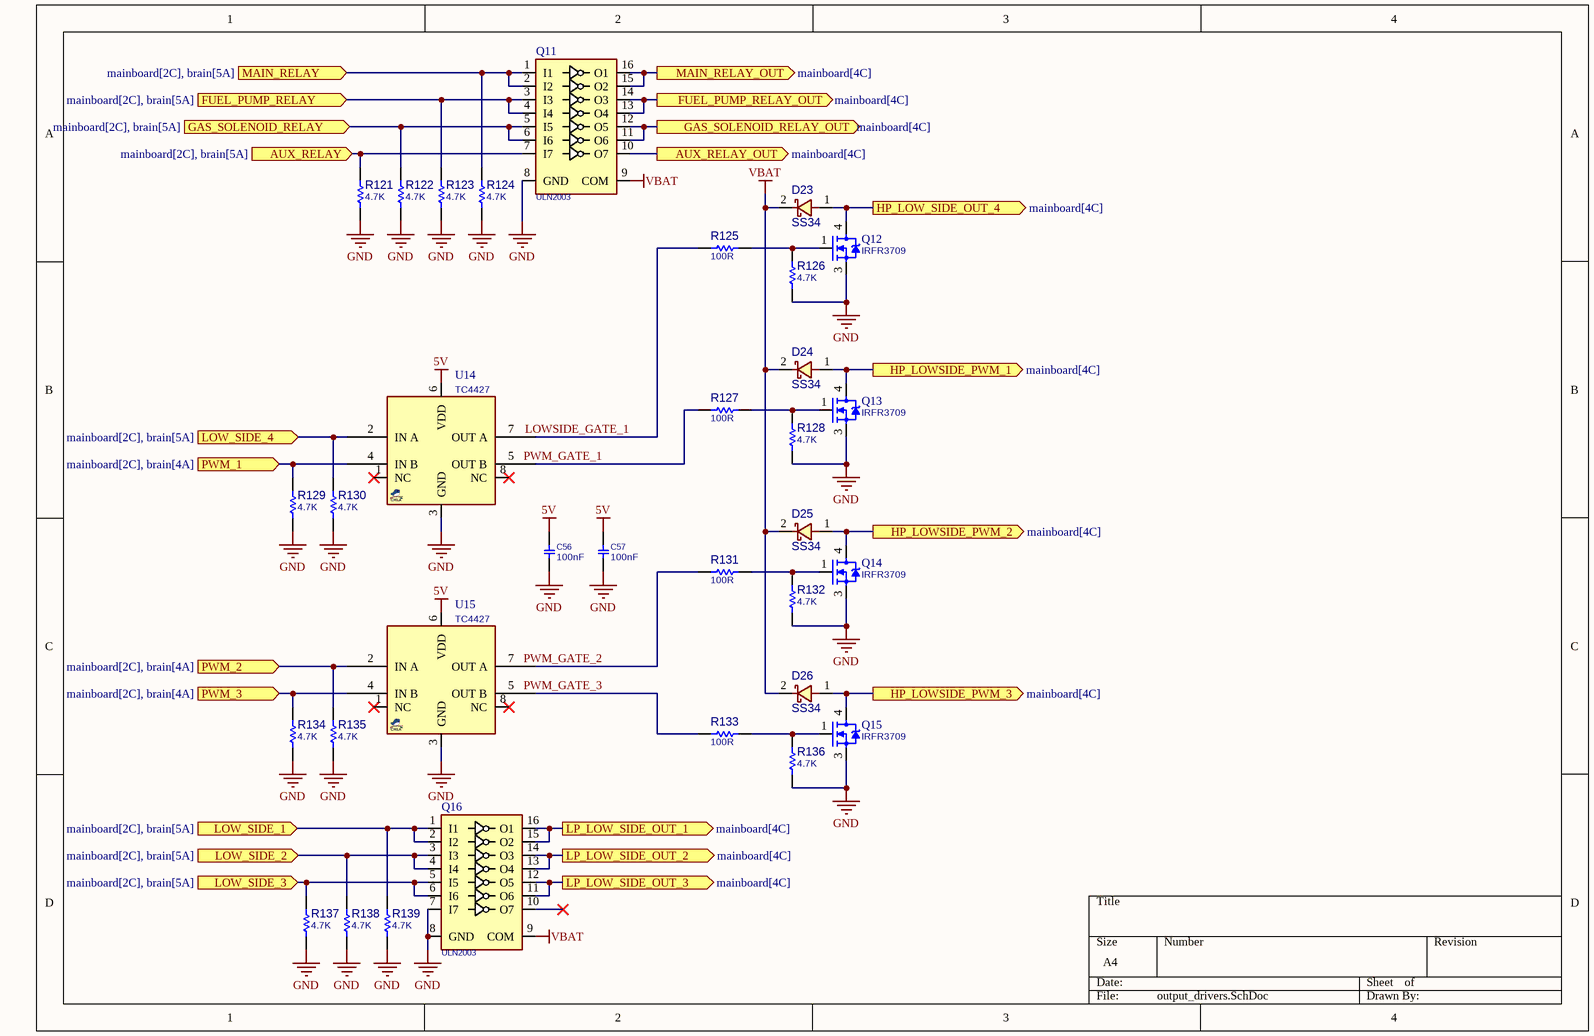
[diagram p6: output_drivers.SchDoc]

### Parts
C56  100nF  [C1206]
C57  100nF  [C1206]
D23  SS34  [D_SMB]
D24  SS34  [D_SMB]
D25  SS34  [D_SMB]
D26  SS34  [D_SMB]
Q11  ULN2003  [SO_16_W]
Q12  IRFR3709  [DPAK_3]
Q13  IRFR3709  [DPAK_3]
Q14  IRFR3709  [DPAK_3]
Q15  IRFR3709  [DPAK_3]
Q16  ULN2003  [SO_16_W]
R121  4.7K  [R0805]
R122  4.7K  [R0805]
R123  4.7K  [R0805]
R124  4.7K  [R0805]
R125  100R  [R1206]
R126  4.7K  [R0805]
R127  100R  [R1206]
R128  4.7K  [R0805]
R129  4.7K  [R0805]
R130  4.7K  [R0805]
R131  100R  [R1206]
R132  4.7K  [R0805]
R133  100R  [R1206]
R134  4.7K  [R0805]
R135  4.7K  [R0805]
R136  4.7K  [R0805]
R137  4.7K  [R0805]
R138  4.7K  [R0805]
R139  4.7K  [R0805]
U14  TC4427  [SO_8]
U15  TC4427  [SO_8]

### Ports
AUX_RELAY (in, see mainboard[2C], brain[5A]), AUX_RELAY_OUT (out, see mainboard[4C]), FUEL_PUMP_RELAY (in, see mainboard[2C], brain[5A]), FUEL_PUMP_RELAY_OUT (out, see mainboard[4C]), GAS_SOLENOID_RELAY (in, see mainboard[2C], brain[5A]), GAS_SOLENOID_RELAY_OUT (out, see mainboard[4C]), HP_LOW_SIDE_OUT_4 (out, see mainboard[4C]), HP_LOWSIDE_PWM_1 (out, see mainboard[4C]), HP_LOWSIDE_PWM_2 (out, see mainboard[4C]), HP_LOWSIDE_PWM_3 (out, see mainboard[4C]), LOW_SIDE_1 (in, see mainboard[2C], brain[5A]), LOW_SIDE_2 (in, see mainboard[2C], brain[5A]), LOW_SIDE_3 (in, see mainboard[2C], brain[5A]), LOW_SIDE_4 (in, see mainboard[2C], brain[5A]), LP_LOW_SIDE_OUT_1 (out, see mainboard[4C]), LP_LOW_SIDE_OUT_2 (out, see mainboard[4C]), LP_LOW_SIDE_OUT_3 (out, see mainboard[4C]), MAIN_RELAY (in, see mainboard[2C], brain[5A]), MAIN_RELAY_OUT (out, see mainboard[4C]), PWM_1 (in, see mainboard[2C], brain[4A]), PWM_2 (in, see mainboard[2C], brain[4A]), PWM_3 (in, see mainboard[2C], brain[4A])

### Nets
5V: C56.2 C57.2 U14.6(VDD) U15.6(VDD)
GND: C56.1 C57.1 Q11.8(GND) Q12.3(S) Q13.3(S) Q14.3(S) Q15.3(S) Q16.7(I7) Q16.8(GND) R121.1 R122.1 R123.1 R124.1 R126.1 R128.1 R129.1 R130.1 R132.1 R134.1 R135.1 R136.1 R137.1 R138.1 R139.1 U14.3(GND) U15.3(GND)
VBAT: D23.2 D24.2 D25.2 D26.2 Q11.9(COM) Q16.9(COM)
LOWSIDE_GATE_1: R125.1 U14.7(OUT_A)
PWM_GATE_1: R127.2 U14.5(OUT_B)
PWM_GATE_2: R131.2 U15.7(OUT_A)
PWM_GATE_3: R133.2 U15.5(OUT_B)
NetD23_1: D23.1 Q12.4(D) ; port HP_LOW_SIDE_OUT_4
NetD24_1: D24.1 Q13.4(D) ; port HP_LOWSIDE_PWM_1
NetD25_1: D25.1 Q14.4(D) ; port HP_LOWSIDE_PWM_2
NetD26_1: D26.1 Q15.4(D) ; port HP_LOWSIDE_PWM_3
NetQ11_1: Q11.1(I1) Q11.2(I2) R124.2 ; port MAIN_RELAY
NetQ11_3: Q11.3(I3) Q11.4(I4) R123.2 ; port FUEL_PUMP_RELAY
NetQ11_5: Q11.5(I5) Q11.6(I6) R122.2 ; port GAS_SOLENOID_RELAY
NetQ11_7: Q11.7(I7) R121.2 ; port AUX_RELAY
NetQ11_10: Q11.10(O7) ; port AUX_RELAY_OUT
NetQ11_11: Q11.11(O6) Q11.12(O5) ; port GAS_SOLENOID_RELAY_OUT
NetQ11_13: Q11.13(O4) Q11.14(O3) ; port FUEL_PUMP_RELAY_OUT
NetQ11_15: Q11.15(O2) Q11.16(O1) ; port MAIN_RELAY_OUT
NetQ12_1: Q12.1(G) R125.2 R126.2
NetQ13_1: Q13.1(G) R127.1 R128.2
NetQ14_1: Q14.1(G) R131.1 R132.2
NetQ15_1: Q15.1(G) R133.1 R136.2
NetQ16_1: Q16.1(I1) Q16.2(I2) R139.2 ; port LOW_SIDE_1
NetQ16_3: Q16.3(I3) Q16.4(I4) R138.2 ; port LOW_SIDE_2
NetQ16_5: Q16.5(I5) Q16.6(I6) R137.2 ; port LOW_SIDE_3
NetQ16_11: Q16.11(O6) Q16.12(O5) ; port LP_LOW_SIDE_OUT_3
NetQ16_13: Q16.13(O4) Q16.14(O3) ; port LP_LOW_SIDE_OUT_2
NetQ16_15: Q16.15(O2) Q16.16(O1) ; port LP_LOW_SIDE_OUT_1
NetR129_2: R129.2 U14.4(IN_B) ; port PWM_1
NetR130_2: R130.2 U14.2(IN_A) ; port LOW_SIDE_4
NetR134_2: R134.2 U15.4(IN_B) ; port PWM_3
NetR135_2: R135.2 U15.2(IN_A) ; port PWM_2

Not connected (* = marked no-connect by the designer): Q16 10(O7)*; U14 1(NC)* 8(NC)*; U15 1(NC)* 8(NC)*

### Library data of the parts
C56 C57 = CAP_SMD_MLCC: as C25 on sheet brain; PRICE: 100= 1$; ASSEMBLY: ASSEMBLY; VALUE: 100nF
D23-D26 = DIODE_SMD_SCHOTTKY_SS34: DIODE, SCHOTTKY, 20V, 3A; MANF: VISHAY; DESC: DESCRIPTION; MANF_P#: SS34; ASSEMBLY: ASSEMBLY; PRICE: PRICE; PARAM2: 3A; PARAM: 20V; VALUE: SS34
Q11 Q16 = ULN2003_SOP16: Darlington, 7-CH, 50V, 0.5A; MANF_P#: ULN2003A; MANF: DIODES; PARAM: 7-CH, 50V, 0.5A; PARAM2: -; VALUE: ULN2003
Q12-Q15 = MOSN_IRFR3709_DPAK: MOSFET, N-CH, 30V, 86A, 6.5mRDS, 2300pF; DESC: HEXFET Power MOSFET; MANF_P#: IRFR3709Z; PARAM2: 30VDS, 1.3~2.2VGSth; PARAM: 86A, 6.5mRDS, 2300pF, -55~175oC; ASSEMBLY: ASSEMBLY; PRICE: 1500t@PAYA; VALUE: IRFR3709
R121-R124 R126 R128-R130 R132 R134-R139 = RES_SMD_0805: as R28 on sheet etb_driver; MANF_P#: -; MANF: -; ASSEMBLY: ASSEMBLY; PRICE: 100= 0.5$; VALUE: 4.7K
R125 R127 R131 R133 = RES_SMD_1206: as R63 on sheet brain; MANF_P#: -; MANF: -; ASSEMBLY: ASSEMBLY; PRICE: -; PARAM2: -; VALUE: 100R
U14 U15 = MOS_DUAL_TC4427: as U1 on sheet coil_inj_drivers; ASSEMBLY: ASSEMBLY; MANF_P#: TC4427; VALUE: TC4427

## Sheet exhaust_gas_temp_oxy.SchDoc
size A4; SheetNumber: 8; SheetTotal: 8
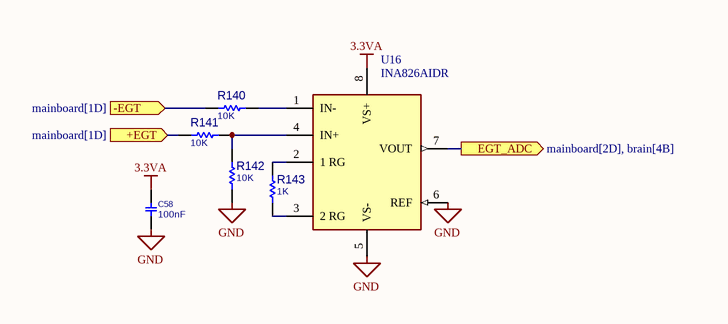
[diagram p7: exhaust_gas_temp_oxy.SchDoc]

### Parts
C58  100nF  [C0805]
R140  10K  [R1206]
R141  10K  [R1206]
R142  10K  [R1206]
R143  1K  [R1206]
U16  INA826AIDR  [SOIC-8]

### Ports
+EGT (in, see mainboard[1D]), -EGT (in, see mainboard[1D]), EGT_ADC (out, see mainboard[2D], brain[4B])

### Nets
3.3VA: C58.2 U16.8(VS+)
GND: C58.1 R142.1 U16.5(VS-) U16.6(REF)
NetR140_1: R140.1 U16.1(IN-)
NetR140_2: R140.2 ; port -EGT
NetR141_1: R141.1 ; port +EGT
NetR141_2: R141.2 R142.2 U16.4(IN+)
NetR143_1: R143.1 U16.3(2_RG)
NetR143_2: R143.2 U16.2(1_RG)
NetU16_7: U16.7(VOUT) ; port EGT_ADC

### Library data of the parts
C58 = CAP_SMD_MLCC_0805: CAP, MLCC; PARAM: -, -%; MANF_P#: MANF_PART#; PARAM2: -V; PRICE: 100= 1$; MANF: -; ASSEMBLY: ASSEMBLY; VALUE: 100nF
R140-R143 = RES_SMD_1206: as R63 on sheet brain; MANF_P#: -; MANF: -; ASSEMBLY: ASSEMBLY; PRICE: -; PARAM2: -
  R140-R142: VALUE: 10K
  R143: VALUE: 1K
U16 = INA826: IC INST AMP 1 CIRCUIT 8SOIC; Number of Circuits: 1; Common Mode Rejection Ratio: 84dB; Power Supply Rejection Ratio (PSRR): 100dB; Input Voltage Noise Density: 18nV/sqrt Hz; Input Resistance: 100kR; Output Current per Channel: 16mA; Input Offset Voltage (Vos): 150uV; Bandwidth: 1MHz; Supply Current: 200uA; Input Bias Current: 65nA; Max Dual Supply Voltage: 18V; Max Supply Voltage: 36V; Min Supply Voltage: 2.7V; Voltage Gain: 60dB; Slew Rate: 1V/µs; Min Dual Supply Voltage: 1.35V; Number of Elements: 1; Series: -; Number of Pins: 8; Lead Free: Lead Free; Output Current: 16mA; REACH SVHC: No SVHC; Min Operating Temperature: -40°C; Quiescent Current: 200uA; Nominal Supply Current: 200uA; Max Operating Temperature: 125°C; RoHS Compliant: Yes; Case/Package: D; -3db Bandwidth: 1MHz; Radiation Hardening: No; Operating Supply Current: 200uA; Packaging: Tape and Reel; Package Quantity: 1; Number of Amplifiers: 1; Number of Channels: 1

## Nets that join several sheets
3.3V: etb_driver (R28.2 R29.2 U7.13 U8.13), brain (15 pins), power (C15.2 C16.2 FB2.2 U6.4)
3.3VA: brain (9 pins), power (C17.2 C18.2 FB2.1 R27.2), exhaust_gas_temp_oxy (C58.2 U16.8)
5V: brain (J11.A4B9 J11.B4A9), power (C9.2 C10.2 FB1.2 U5.4), coil_inj_drivers (8 pins), trigger_interface (14 pins), output_drivers (C56.2 C57.2 U14.6 U15.6)
GND: mainboard (7 pins), etb_driver (20 pins), brain (76 pins), power (21 pins), coil_inj_drivers (37 pins), trigger_interface (14 pins), output_drivers (26 pins), exhaust_gas_temp_oxy (C58.1 R142.1 U16.5 U16.6)
VBAT: etb_driver (10 pins), brain (R59.2), power (5 pins), output_drivers (6 pins)
NetD1_1: mainboard (J2.5), coil_inj_drivers (D1.1 T1.4)
NetD1_2: mainboard (J2.6 J2.7 J2.8), coil_inj_drivers (11 pins)
NetF2_1: mainboard (J1.1 J1.2), power (F2.1)
NetJ2_1: mainboard (J2.1), coil_inj_drivers (Q1.4)
NetJ2_2: mainboard (J2.2), coil_inj_drivers (Q2.4)
NetJ2_3: mainboard (J2.3), coil_inj_drivers (Q3.4)
NetJ2_4: mainboard (J2.4), coil_inj_drivers (Q4.4)
NetJ3_1: mainboard (J3.1), etb_driver (U7.6 U7.7)
NetJ3_2: mainboard (J3.2), etb_driver (U7.14 U7.15)
NetJ3_3: mainboard (J3.3), etb_driver (U8.6 U8.7)
NetJ3_4: mainboard (J3.4), etb_driver (U8.14 U8.15)